# Altium schematic sheet Enzo.SchDoc
size A; SheetNumber: 6; SheetTotal: 6
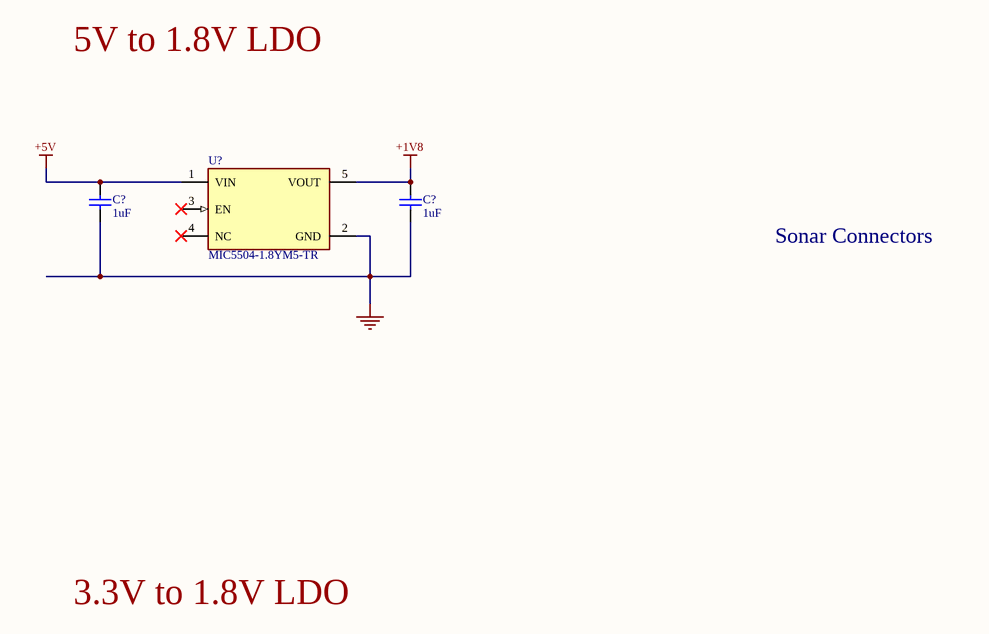
[diagram p0: Enzo.SchDoc]

## Parts
(Parts that share a designator on the sheet are numbered #1, #2 ... from top to bottom, then left to right.)
C?#1  1uF  [CAPC1608X87X35LL15T15]
C?#2  1uF  [CAPC1608X87X35LL15T15]
U?  MIC5504-1.8YM5-TR  [FP-SOT23-5LD-PL-1-MFG]

## Nets
+1V8: C?#2.2 U?.5(VOUT)
+5V: C?#1.2 U?.1(VIN)
GND: C?#1.1 C?#2.1 U?.2(GND)

Not connected (* = marked no-connect by the designer): U? 3(EN)* 4(NC)*

## Notes on the sheet
- 5V to 1.8V LDO
- Sonar Connectors
- 3.3V to 1.8V LDO

## Library data of the parts
C?#1 C?#2 = CMP-2006-03713-1: Part Number: C0603C105K3RACTU; Manufacturer: Kemet
U? = CMP-06324-000021-1: IC REG LINEAR 1.8V 300MA SOT23-5; Manufacturer: Microchip; Dropout Voltage: 160mV; Number Of Outputs: 1; Nominal Supply Current: 38-42uA; Accuracy Percentage: 2%; Max Supply Voltage: 5.5V; Max Junction Temp: +125°C; Min Supply Voltage: 2.5V; Standoff Height: 0mm; Output Type: Fixed; Temperature Range Low: -40°C; Temperature Range High: +125°C; Automotive: No; Octopart: https://octopart.com/mic5504-1.8ym5-tr-microchip-66803399; RoHS: TRUE; Device Class L1: Integrated Circuits (ICs); Device Class L3: Voltage Regulators - Linear; Package: SOT23-5LD-PL-1; Device Class L2: Power Management ICs; Output Current: 300mA; Digikey Description: IC REG LINEAR 1.8V 300MA SOT23-5; Lead Free: Yes; Output Voltage: 1.8V; Height: 1.45mm; Category: IC; ComponentLink2Description: Datasheet; Temperature: -40°C to +125°C; ComponentLink2URL: http://ww1.microchip.com/downloads/en/DeviceDoc/MIC5501-02-03-04-300mA-Single-Output-LDO-in-Small-Packages-DS20006006B.pdf; Manufacturer Part Number: MIC5504-1.8YM5-TR